# Altium schematic sheet P07_BCS1_Exp Conn.SchDoc
size A3; Date: 24.11.2011; CheckedBy: Finke; Author: Mierau; DrawnBy: Mierau; SheetNumber: 1; SheetTotal: 8; Anlage: 78; Beschreibung: Qseven; Kunde: 56; ProjektName: BCS1; ProjektNummer: 88xxx; Ersatz_fuer: 12; ersetzt_durch: 34; LKNummer: 6190202; ID_Nummer: 90
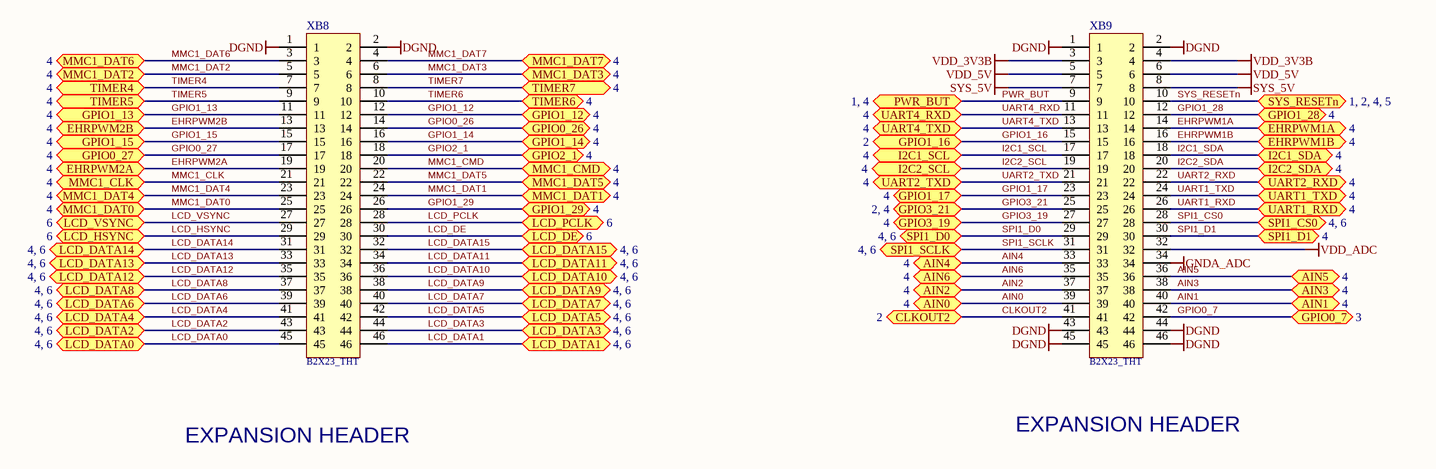
[diagram p0: P07_BCS1_Exp Conn.SchDoc]

## Parts
XB8  B2X23_THT  [BU2X23]
XB9  B2X23_THT  [BU2X23]

## Ports
AIN0 (see 4), AIN1 (see 4), AIN2 (see 4), AIN3 (see 4), AIN4 (see 4), AIN5 (see 4), AIN6 (see 4), CLKOUT2 (see 2), EHRPWM1A (see 4), EHRPWM1B (see 4), EHRPWM2A (see 4), EHRPWM2B (see 4), GPIO0_7 (see 3), GPIO0_26 (see 4), GPIO0_27 (see 4), GPIO1_12 (see 4), GPIO1_13 (see 4), GPIO1_14 (see 4), GPIO1_15 (see 4), GPIO1_16 (see 2), GPIO1_17 (see 4), GPIO1_28 (see 4), GPIO1_29 (see 4), GPIO2_1 (see 4), GPIO3_19 (see 4), GPIO3_21 (see 2, 4), I2C1_SCL (see 4), I2C1_SDA (see 4), I2C2_SCL (see 4), I2C2_SDA (see 4), LCD_DATA0 (see 4, 6), LCD_DATA1 (see 4, 6), LCD_DATA2 (see 4, 6), LCD_DATA3 (see 4, 6), LCD_DATA4 (see 4, 6), LCD_DATA5 (see 4, 6), LCD_DATA6 (see 4, 6), LCD_DATA7 (see 4, 6), LCD_DATA8 (see 4, 6), LCD_DATA9 (see 4, 6), LCD_DATA10 (see 4, 6), LCD_DATA11 (see 4, 6), LCD_DATA12 (see 4, 6), LCD_DATA13 (see 4, 6), LCD_DATA14 (see 4, 6), LCD_DATA15 (see 4, 6), LCD_DE (see 6), LCD_HSYNC (see 6), LCD_PCLK (see 6), LCD_VSYNC (see 6), MMC1_CLK (see 4), MMC1_CMD (see 4), MMC1_DAT0 (see 4), MMC1_DAT1 (see 4), MMC1_DAT2 (see 4), MMC1_DAT3 (see 4), MMC1_DAT4 (see 4), MMC1_DAT5 (see 4), MMC1_DAT6 (see 4), MMC1_DAT7 (see 4), PWR_BUT (see 1, 4), SPI1_CS0 (see 4, 6), SPI1_D0 (see 4, 6), SPI1_D1 (see 4), SPI1_SCLK (see 4, 6), SYS_RESETn (see 1, 2, 4, 5), TIMER4 (see 4), TIMER5 (see 4), TIMER6 (see 4), TIMER7 (see 4), UART1_RXD (see 4), UART1_TXD (see 4), UART2_RXD (see 4), UART2_TXD (see 4), UART4_RXD (see 4), UART4_TXD (see 4)

## Nets
DGND: XB8.1 XB8.2 XB9.1 XB9.2 XB9.43 XB9.44 XB9.45 XB9.46
GNDA_ADC: XB9.34
SYS_5V: XB9.7 XB9.8
VDD_3V3B: XB9.3 XB9.4
VDD_5V: XB9.5 XB9.6
VDD_ADC: XB9.32
AIN0: XB9.39 ; port AIN0
AIN1: XB9.40 ; port AIN1
AIN2: XB9.37 ; port AIN2
AIN3: XB9.38 ; port AIN3
AIN4: XB9.33 ; port AIN4
AIN5: XB9.36 ; port AIN5
AIN6: XB9.35 ; port AIN6
CLKOUT2: XB9.41 ; port CLKOUT2
EHRPWM1A: XB9.14 ; port EHRPWM1A
EHRPWM1B: XB9.16 ; port EHRPWM1B
EHRPWM2A: XB8.19 ; port EHRPWM2A
EHRPWM2B: XB8.13 ; port EHRPWM2B
GPIO0_7: XB9.42 ; port GPIO0_7
GPIO0_26: XB8.14 ; port GPIO0_26
GPIO0_27: XB8.17 ; port GPIO0_27
GPIO1_12: XB8.12 ; port GPIO1_12
GPIO1_13: XB8.11 ; port GPIO1_13
GPIO1_14: XB8.16 ; port GPIO1_14
GPIO1_15: XB8.15 ; port GPIO1_15
GPIO1_16: XB9.15 ; port GPIO1_16
GPIO1_17: XB9.23 ; port GPIO1_17
GPIO1_28: XB9.12 ; port GPIO1_28
GPIO1_29: XB8.26 ; port GPIO1_29
GPIO2_1: XB8.18 ; port GPIO2_1
GPIO3_19: XB9.27 ; port GPIO3_19
GPIO3_21: XB9.25 ; port GPIO3_21
I2C1_SCL: XB9.17 ; port I2C1_SCL
I2C1_SDA: XB9.18 ; port I2C1_SDA
I2C2_SCL: XB9.19 ; port I2C2_SCL
I2C2_SDA: XB9.20 ; port I2C2_SDA
LCD_DATA0: XB8.45 ; port LCD_DATA0
LCD_DATA1: XB8.46 ; port LCD_DATA1
LCD_DATA2: XB8.43 ; port LCD_DATA2
LCD_DATA3: XB8.44 ; port LCD_DATA3
LCD_DATA4: XB8.41 ; port LCD_DATA4
LCD_DATA5: XB8.42 ; port LCD_DATA5
LCD_DATA6: XB8.39 ; port LCD_DATA6
LCD_DATA7: XB8.40 ; port LCD_DATA7
LCD_DATA8: XB8.37 ; port LCD_DATA8
LCD_DATA9: XB8.38 ; port LCD_DATA9
LCD_DATA10: XB8.36 ; port LCD_DATA10
LCD_DATA11: XB8.34 ; port LCD_DATA11
LCD_DATA12: XB8.35 ; port LCD_DATA12
LCD_DATA13: XB8.33 ; port LCD_DATA13
LCD_DATA14: XB8.31 ; port LCD_DATA14
LCD_DATA15: XB8.32 ; port LCD_DATA15
LCD_DE: XB8.30 ; port LCD_DE
LCD_HSYNC: XB8.29 ; port LCD_HSYNC
LCD_PCLK: XB8.28 ; port LCD_PCLK
LCD_VSYNC: XB8.27 ; port LCD_VSYNC
MMC1_CLK: XB8.21 ; port MMC1_CLK
MMC1_CMD: XB8.20 ; port MMC1_CMD
MMC1_DAT0: XB8.25 ; port MMC1_DAT0
MMC1_DAT1: XB8.24 ; port MMC1_DAT1
MMC1_DAT2: XB8.5 ; port MMC1_DAT2
MMC1_DAT3: XB8.6 ; port MMC1_DAT3
MMC1_DAT4: XB8.23 ; port MMC1_DAT4
MMC1_DAT5: XB8.22 ; port MMC1_DAT5
MMC1_DAT6: XB8.3 ; port MMC1_DAT6
MMC1_DAT7: XB8.4 ; port MMC1_DAT7
PWR_BUT: XB9.9 ; port PWR_BUT
SPI1_CS0: XB9.28 ; port SPI1_CS0
SPI1_D0: XB9.29 ; port SPI1_D0
SPI1_D1: XB9.30 ; port SPI1_D1
SPI1_SCLK: XB9.31 ; port SPI1_SCLK
SYS_RESETn: XB9.10 ; port SYS_RESETn
TIMER4: XB8.7 ; port TIMER4
TIMER5: XB8.9 ; port TIMER5
TIMER6: XB8.10 ; port TIMER6
TIMER7: XB8.8 ; port TIMER7
UART1_RXD: XB9.26 ; port UART1_RXD
UART1_TXD: XB9.24 ; port UART1_TXD
UART2_RXD: XB9.22 ; port UART2_RXD
UART2_TXD: XB9.21 ; port UART2_TXD
UART4_RXD: XB9.11 ; port UART4_RXD
UART4_TXD: XB9.13 ; port UART4_TXD

## Notes on the sheet
- EXPANSION HEADER
- Date
- Name
- REV.:
- editor:
- CAD:
- - SL (3)
- sheet:
- LK :
- checked:
- of:

## Library data of the parts
XB8 XB9 = XB2X23_THT: Buchsenleiste 46pol. IDC, vertikal 2.54mm pitch; Hersteller: Sullins Connector Solutions; Bestellbezeichnung: PPPC232LFBN-RC; Value: B2X23_THT